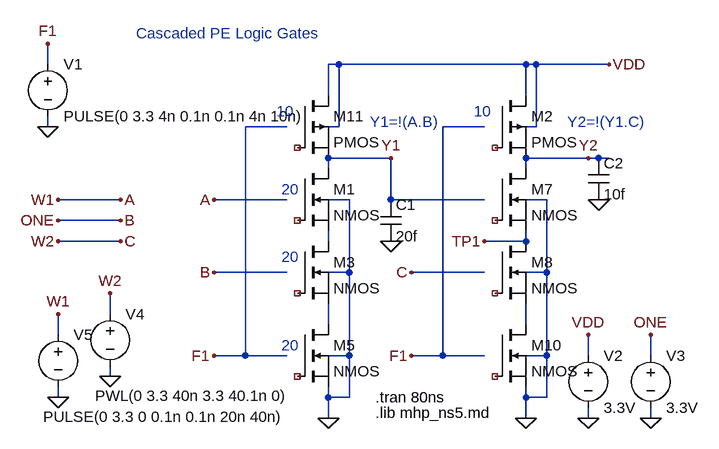
[diagram p0: schematic pe_nand_cascade.asc]
pe_nand_cascade.asc, the LTspice schematic file:
Version 4
SHEET 1 1292 680
WIRE -1920 -448 -1920 -480
WIRE -1472 -448 -1488 -448
WIRE -1184 -448 -1472 -448
WIRE -1168 -448 -1184 -448
WIRE -1056 -448 -1168 -448
WIRE -1488 -400 -1488 -448
WIRE -1184 -400 -1184 -448
WIRE -1920 -352 -1920 -368
WIRE -1552 -352 -1616 -352
WIRE -1472 -352 -1472 -448
WIRE -1472 -352 -1488 -352
WIRE -1248 -352 -1312 -352
WIRE -1168 -352 -1168 -448
WIRE -1168 -352 -1184 -352
WIRE -1392 -304 -1488 -304
WIRE -1088 -304 -1184 -304
WIRE -1072 -304 -1088 -304
WIRE -1056 -304 -1072 -304
WIRE -1488 -288 -1488 -304
WIRE -1184 -288 -1184 -304
WIRE -1808 -240 -1904 -240
WIRE -1552 -240 -1664 -240
WIRE -1456 -240 -1488 -240
WIRE -1392 -240 -1392 -304
WIRE -1248 -240 -1392 -240
WIRE -1152 -240 -1184 -240
WIRE -1808 -208 -1904 -208
WIRE -1808 -176 -1904 -176
WIRE -1488 -176 -1488 -192
WIRE -1184 -176 -1184 -192
WIRE -1184 -176 -1248 -176
WIRE -1552 -128 -1664 -128
WIRE -1456 -128 -1456 -240
WIRE -1456 -128 -1488 -128
WIRE -1248 -128 -1360 -128
WIRE -1152 -128 -1152 -240
WIRE -1152 -128 -1184 -128
WIRE -1824 -64 -1824 -96
WIRE -1488 -48 -1488 -80
WIRE -1184 -48 -1184 -80
WIRE -1904 -32 -1904 -64
WIRE -1616 0 -1616 -352
WIRE -1616 0 -1664 0
WIRE -1552 0 -1616 0
WIRE -1456 0 -1456 -128
WIRE -1456 0 -1488 0
WIRE -1312 0 -1312 -352
WIRE -1312 0 -1360 0
WIRE -1248 0 -1312 0
WIRE -1152 0 -1152 -128
WIRE -1152 0 -1184 0
WIRE -1088 0 -1088 -32
WIRE -992 0 -992 -32
WIRE -1824 32 -1824 16
WIRE -1904 64 -1904 48
WIRE -1488 64 -1488 48
WIRE -1456 64 -1456 0
WIRE -1456 64 -1488 64
WIRE -1184 64 -1184 48
WIRE -1152 64 -1152 0
WIRE -1152 64 -1184 64
WIRE -1488 96 -1488 64
WIRE -1184 96 -1184 64
WIRE -1088 96 -1088 80
WIRE -992 96 -992 80
FLAG -1184 96 0
FLAG -1360 0 F1
FLAG -1488 96 0
FLAG -1664 0 F1
FLAG -1088 96 0
FLAG -1920 -352 0
FLAG -1088 -32 VDD
FLAG -1920 -480 F1
FLAG -1392 -304 Y1
FLAG -1088 -304 Y2
FLAG -1056 -448 VDD
FLAG -992 96 0
FLAG -992 -32 ONE
FLAG -1664 -240 A
FLAG -1248 -176 TP1
FLAG -1392 -176 0
FLAG -1072 -240 0
FLAG -1808 -208 B
FLAG -1904 -176 W2
FLAG -1904 -208 ONE
FLAG -1824 32 0
FLAG -1824 -96 W2
FLAG -1904 -240 W1
FLAG -1808 -240 A
FLAG -1904 64 0
FLAG -1904 -64 W1
FLAG -1360 -128 C
FLAG -1808 -176 C
FLAG -1664 -128 B
SYMBOL pmos -1232 -400 R0
SYMATTR InstName M2
SYMATTR Value2 l=0.6u w=3u
SYMBOL pmos -1536 -400 R0
SYMATTR InstName M11
SYMATTR Value2 l=0.6u w=3u
SYMBOL voltage -1920 -464 R0
WINDOW 123 0 0 Left 2
WINDOW 39 0 0 Left 2
SYMATTR InstName V1
SYMATTR Value PULSE(0 3.3 4n 0.1n 0.1n 4n 10n)
SYMBOL voltage -1088 -16 R0
WINDOW 123 0 0 Left 2
WINDOW 39 0 0 Left 2
SYMATTR InstName V2
SYMATTR Value 3.3V
SYMBOL nmos -1536 -288 R0
SYMATTR InstName M1
SYMATTR SpiceModel ""
SYMATTR Value NMOS
SYMATTR Value2 l=0.6u w=6u
SYMBOL nmos -1536 -176 R0
SYMATTR InstName M3
SYMATTR SpiceModel ""
SYMATTR Value NMOS
SYMATTR Value2 l=0.6u w=6u
SYMBOL nmos -1536 -48 R0
SYMATTR InstName M5
SYMATTR SpiceModel ""
SYMATTR Value NMOS
SYMATTR Value2 l=0.6u w=6u
SYMBOL nmos -1232 -288 R0
SYMATTR InstName M7
SYMATTR SpiceModel ""
SYMATTR Value NMOS
SYMATTR Value2 l=0.6u w=6u
SYMBOL nmos -1232 -176 R0
SYMATTR InstName M8
SYMATTR SpiceModel ""
SYMATTR Value NMOS
SYMATTR Value2 l=0.6u w=6u
SYMBOL nmos -1232 -48 R0
SYMATTR InstName M10
SYMATTR SpiceModel ""
SYMATTR Value NMOS
SYMATTR Value2 l=0.6u w=6u
SYMBOL voltage -992 -16 R0
WINDOW 123 0 0 Left 2
WINDOW 39 0 0 Left 2
SYMATTR InstName V3
SYMATTR Value 3.3V
SYMBOL cap -1408 -240 R0
SYMATTR InstName C1
SYMATTR Value 20f
SYMBOL cap -1088 -304 R0
SYMATTR InstName C2
SYMATTR Value 10f
SYMBOL voltage -1824 -80 R0
WINDOW 123 0 0 Left 2
WINDOW 39 0 0 Left 2
WINDOW 3 -23 142 Left 2
SYMATTR InstName V4
SYMATTR Value PWL(0 3.3 40n 3.3 40.1n 0)
SYMBOL voltage -1904 -48 R0
WINDOW 123 0 0 Left 2
WINDOW 39 0 0 Left 2
WINDOW 3 -23 142 Left 2
SYMATTR InstName V5
SYMATTR Value PULSE(0 3.3 0 0.1n 0.1n 20n 40n)
TEXT -1264 -376 Left 2 ;10
TEXT -1568 -376 Left 2 ;10
TEXT -1416 88 Left 2 !.lib mhp_ns5.md
TEXT -1416 64 Left 2 !.tran 80ns
TEXT -1784 -496 Left 2 ;Cascaded PE Logic Gates
TEXT -1560 -256 Left 2 ;20
TEXT -1560 -152 Left 2 ;20
TEXT -1560 -16 Left 2 ;20
TEXT -1424 -360 Left 2 ;Y1=!(A.B)
TEXT -1120 -360 Left 2 ;Y2=!(Y1.C)

The netlist it stands for:
* pe_nand_cascade.asc
* M2: PMOS l=0.6u w=3u (symbol pmos not certain, pin order unknown); nets seen at it: VDD, Y2
* M11: PMOS l=0.6u w=3u (symbol pmos not certain, pin order unknown); nets seen at it: VDD, Y1
V1 F1 0 PULSE(0 3.3 4n 0.1n 0.1n 4n 10n)
V2 VDD 0 3.3V
* M1: NMOS l=0.6u w=6u (symbol nmos not certain, pin order unknown); nets seen at it: N001, Y1
* M3: NMOS l=0.6u w=6u (symbol nmos not certain, pin order unknown); nets seen at it: N001, N002
* M5: NMOS l=0.6u w=6u (symbol nmos not certain, pin order unknown); nets seen at it: 0, N002
* M7: NMOS l=0.6u w=6u (symbol nmos not certain, pin order unknown); nets seen at it: TP1, Y2
* M8: NMOS l=0.6u w=6u (symbol nmos not certain, pin order unknown); nets seen at it: N003, TP1
* M10: NMOS l=0.6u w=6u (symbol nmos not certain, pin order unknown); nets seen at it: 0, N003
V3 B 0 3.3V
C1 Y1 0 20f
C2 Y2 0 10f
V4 C 0 PWL(0 3.3 40n 3.3 40.1n 0)
V5 W1 0 PULSE(0 3.3 0 0.1n 0.1n 20n 40n)
* 10
* 10
.lib mhp_ns5.md
.tran 80ns
* Cascaded PE Logic Gates
* 20
* 20
* 20
* Y1=!(A.B)
* Y2=!(Y1.C)
.backanno
.end